# Altium project watch.PrjPcb
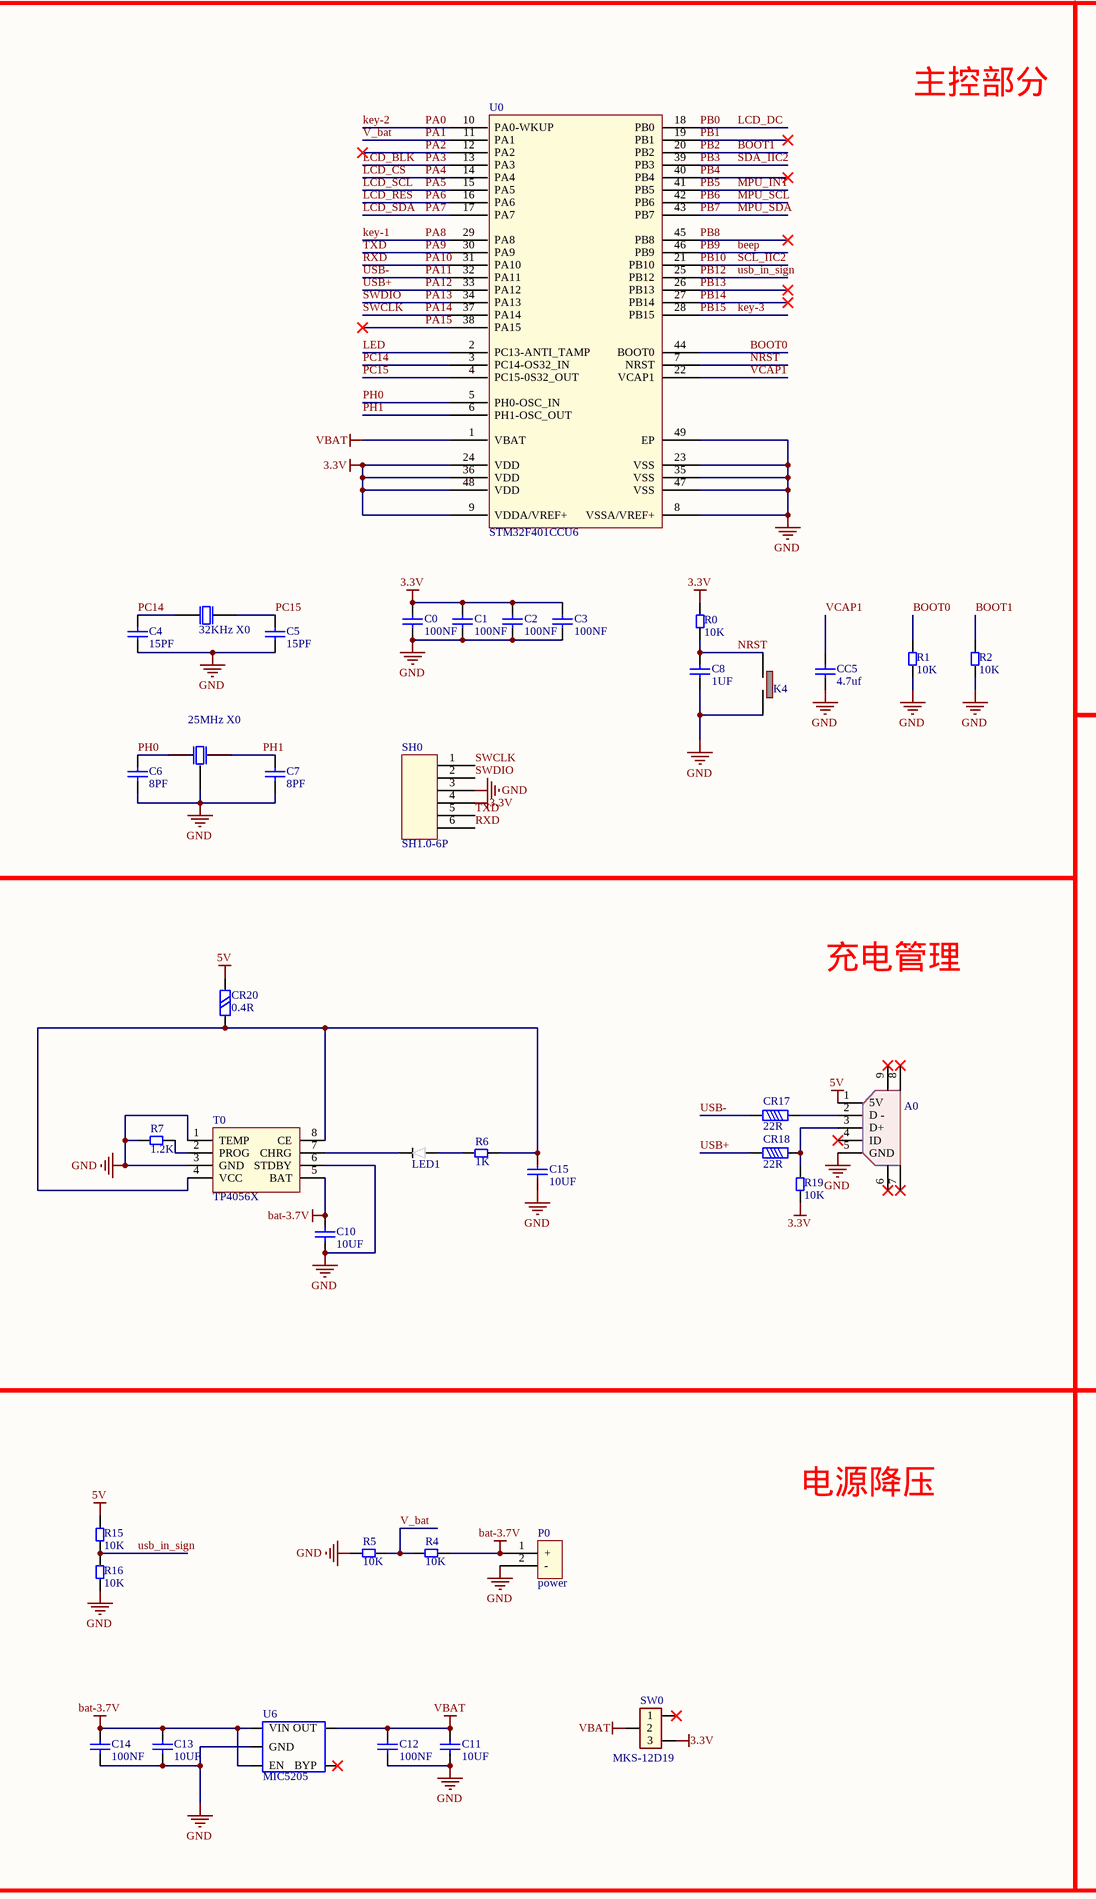
[diagram p0: Sheet-watch.SchDoc, left]
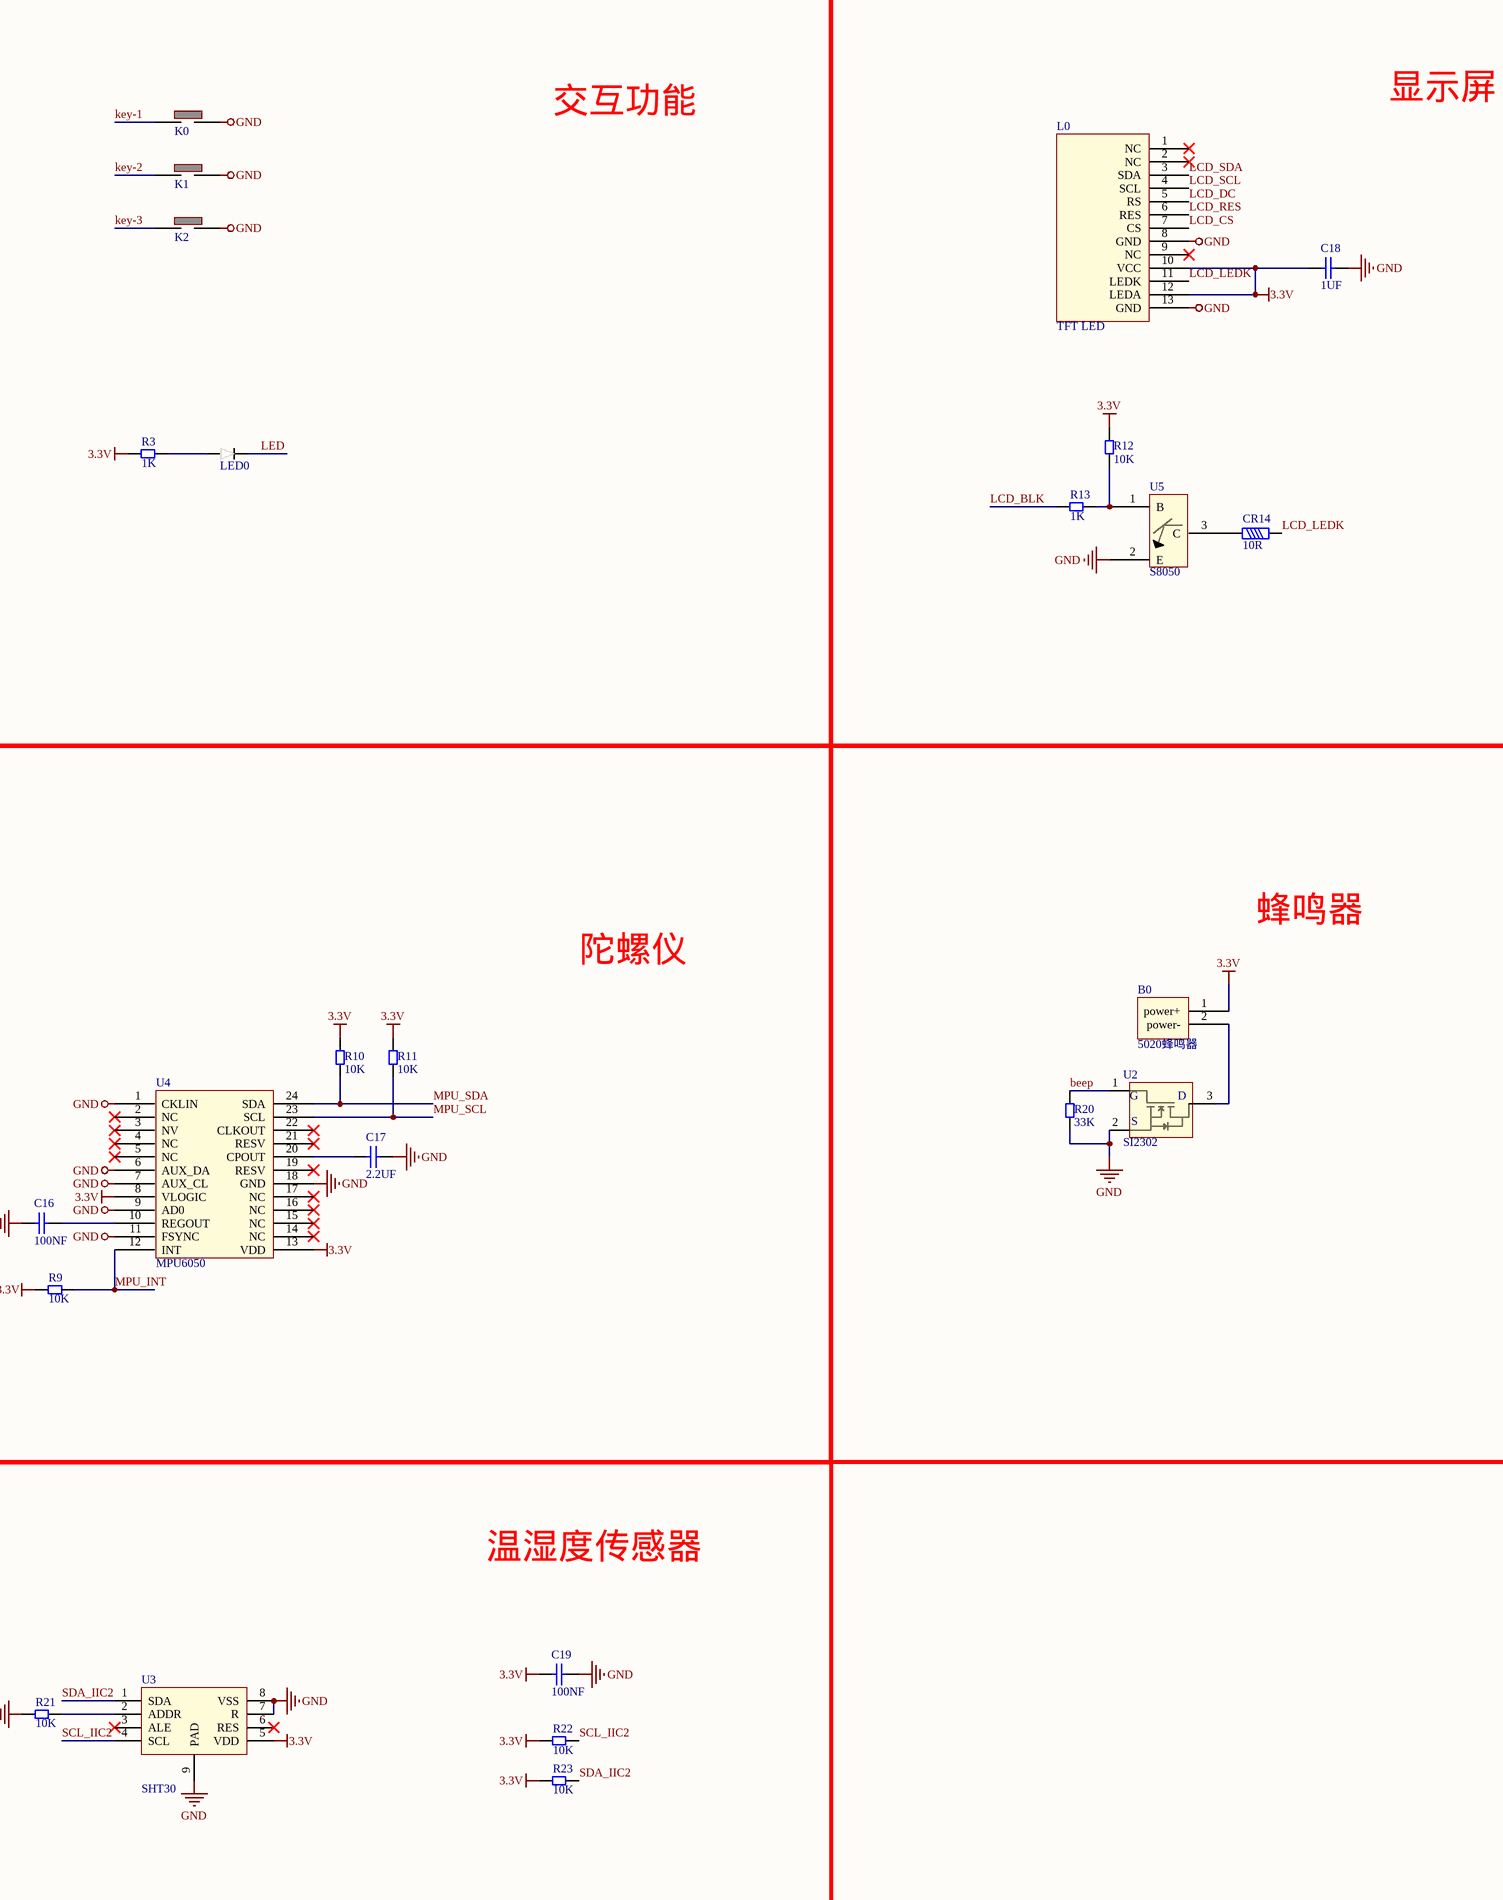
[diagram p1: Sheet-watch.SchDoc, right]
1 sheet, 65 parts. Net scope: global (net labels, ports and power ports of the same name join across sheets).
Board file: PCB-watch.PcbDoc

## Sheet Sheet-watch.SchDoc
size A2; Organization: Protel International P/L; Address1: L3, 12a Rodborough Rd; Address2: Frenchs Forest; Address3: NSW; Address4: Australia 2086

### Parts
25MHz_X0  XTAL 3225 8M  [T 3225]  (value not drawn)
32KHz_X0  XTAL 3215 32.768kKHz  [T 3215]  (value not drawn)
A0  Micro USB  [Micro usb AB]  (value not drawn)
B0  5020蜂鸣器  [5020蜂鸣器]
C0  100NF  [0402Capacitor]
C1  100NF  [0402Capacitor]
C2  100NF  [0402Capacitor]
C3  100NF  [0402Capacitor]
C4  15PF  [0402Capacitor]
C5  15PF  [0402Capacitor]
C6  8PF  [0402Capacitor]
C7  8PF  [0402Capacitor]
C8  1UF  [0402Capacitor]
C10  10UF  [0402Capacitor]
C11  10UF  [0402Capacitor]
C12  100NF  [0402Capacitor]
C13  10UF  [0402Capacitor]
C14  100NF  [0402Capacitor]
C15  10UF  [0402Capacitor]
C16  100NF  [0402Capacitor]
C17  2.2UF  [0402Capacitor]
C18  1UF  [0402Capacitor]
C19  100NF  [0402Capacitor]
CC5  value 4.7uf  [CC1608-0603]  (hidden comment: Cap Chip 0603)
CR14  value 10R  [CR1608-0603]  (hidden comment: Resistor Chip 0603)
CR17  value 22R  [CR1608-0603]  (hidden comment: Resistor Chip 0603)
CR18  value 22R  [CR1608-0603]  (hidden comment: Resistor Chip 0603)
CR20  value 0.4R  [CR3216-1206]  (hidden comment: Resistor Chip 1206)
K0  KEY 3*4  [2*4*3.5 KEY]  (value not drawn)
K1  KEY 3*4  [2*4*3.5 KEY]  (value not drawn)
K2  KEY 3*4  [2*4*3.5 KEY]  (value not drawn)
K4  KEY 3*4  [KEY 3*4]  (value not drawn)
L0  TFT LED  [LCD-1.14IPS-(2)]
LED0  0402 LED  [0402 LED]  (value not drawn)
LED1  0402 LED  [0402 LED]  (value not drawn)
P0  power  [POWER-3.7V]
R0  10K  [0402resistor]
R1  10K  [0402resistor]
R2  10K  [0402resistor]
R3  1K  [0402resistor]
R4  10K  [0402resistor]
R5  10K  [0402resistor]
R6  1K  [0402resistor]
R7  1.2K  [0402resistor]
R9  10K  [0402resistor]
R10  10K  [0402resistor]
R11  10K  [0402resistor]
R12  10K  [0402resistor]
R13  1K  [0402resistor]
R15  10K  [0402resistor]
R16  10K  [0402resistor]
R19  10K  [0402resistor]
R20  33K  [0402resistor]
R21  10K  [0402resistor]
R22  10K  [0402resistor]
R23  10K  [0402resistor]
SH0  SH1.0-6P  [SH1.0-6P]
SW0  MKS-12D19  [SW  MSK-02]
T0  TP4056X  [ESOP8]
U0  STM32F401CCU6  [STM32-UFQFPN48_N]
U2  SI2302  [SOT-23 SI2302]
U3  SHT30  [SHT3X-DIS]
U4  MPU6050  [QFN24 - duplicate]
U5  S8050  [SOT-23 SI2302]
U6  MIC5205  [SOT23-5]

### Blocks framed on the sheet
主控部分: 25MHz_X0 32KHz_X0 C0-C8 CC5 K4 R0-R2 SH0 U0
交互功能: K0-K2 LED0 R3
充电管理: A0 C10 C15 CR17 CR18 CR20 LED1 R6 R7 R19 T0

### Nets
3.3V: B0.1(power+) C0.2 C1.2 C2.2 C3.2 C18.2 C19.2 L0.10(VCC) L0.12(LEDA) R0.2 R3.2 R9.2 R10.2 R11.2 R12.2 R19.1 R22.2 R23.2 SH0.4 SW0.3 U0.9(VDDA/VREF+) U0.24(VDD) U0.36(VDD) U0.48(VDD) U3.5(VDD) U4.8(VLOGIC) U4.13(VDD)
5V: A0.1(5V) CR20.2 R15.2
bat-3.7V: C10.2 C13.2 C14.2 P0.1(+) R4.1 T0.5(BAT) U6.1(VIN) U6.3(EN)
GND: 25MHz_X0.3(GND) A0.5(GND) C0.1 C1.1 C2.1 C3.1 C4.1 C5.1 C6.1 C7.1 C8.1 C10.1 C11.1 C12.1 C13.1 C14.1 C15.1 C16.2 C17.1 C18.1 C19.1 CC5.1 K0.2 K1.2 K2.2 K4.2 L0.8(GND) L0.13(GND) P0.2(-) R1.1 R2.1 R5.2 R7.2 R16.1 R20.1 R21.2 SH0.3 T0.1(TEMP) T0.3(GND) T0.6(STDBY) U0.8(VSSA/VREF+) U0.23(VSS) U0.35(VSS) U0.47(VSS) U0.49(EP) U2.2(SOURCE) U3.7(R) U3.8(VSS) U3.9(PAD) U4.1(CKLIN) U4.6(AUX_DA) U4.7(AUX_CL) U4.9(AD0) U4.11(FSYNC) U4.18(GND) U5.2(E) U6.2(GND)
VBAT: C11.2 C12.2 SW0.2 U0.1(VBAT) U6.5(OUT)
beep: R20.2 U0.46(PB9) U2.1(GATE)  [also labelled PB9]
BOOT0: R1.2 U0.44(BOOT0)
BOOT1: R2.2 U0.20(PB2)  [also labelled PB2]
key-1: K0.1 U0.29(PA8)  [also labelled PA8]
key-2: K1.1 U0.10(PA0-WKUP)  [also labelled PA0]
key-3: K2.1 U0.28(PB15)  [also labelled PB15]
LCD_BLK: R13.2 U0.13(PA3)  [also labelled PA3]
LCD_CS: L0.7(CS) U0.14(PA4)  [also labelled PA4]
LCD_DC: L0.5(RS) U0.18(PB0)  [also labelled PB0]
LCD_LEDK: CR14.2 L0.11(LEDK)
LCD_RES: L0.6(RES) U0.16(PA6)  [also labelled PA6]
LCD_SCL: L0.4(SCL) U0.15(PA5)  [also labelled PA5]
LCD_SDA: L0.3(SDA) U0.17(PA7)  [also labelled PA7]
LED: LED0.2 U0.2(PC13-ANTI_TAMP)
MPU_INT: R9.1 U0.41(PB5) U4.12(INT)  [also labelled PB5]
MPU_SCL: R11.1 U0.42(PB6) U4.23(SCL)  [also labelled PB6]
MPU_SDA: R10.1 U0.43(PB7) U4.24(SDA)  [also labelled PB7]
NRST: C8.2 K4.1 R0.1 U0.7(NRST)
PA1: R4.2 R5.1 U0.11(PA1)  [also labelled V_bat]
PA2: U0.12(PA2)
PA9: SH0.5 U0.30(PA9)  [also labelled TXD]
PA10: SH0.6 U0.31(PA10)  [also labelled RXD]
PA11: CR17.1 U0.32(PA11)  [also labelled USB-]
PA12: CR18.1 U0.33(PA12)  [also labelled USB+]
PA13: SH0.2 U0.34(PA13)  [also labelled SWDIO]
PA14: SH0.1 U0.37(PA14)  [also labelled SWCLK]
PA15: U0.38(PA15)
PB1: U0.19(PB1)
PB3: R23.1 U0.39(PB3) U3.1(SDA)  [also labelled SDA_IIC2]
PB4: U0.40(PB4)
PB8: U0.45(PB8)
PB10: R22.1 U0.21(PB10) U3.4(SCL)  [also labelled SCL_IIC2]
PB12: R15.1 R16.2 U0.25(PB12)  [also labelled usb_in_sign]
PB13: U0.26(PB13)
PB14: U0.27(PB14)
PC14: 32KHz_X0.1(OSC1) C4.2 U0.3(PC14-OS32_IN)
PC15: 32KHz_X0.2(OSC2) C5.2 U0.4(PC15-0S32_OUT)
PH0: 25MHz_X0.1(OSC1) C6.2 U0.5(PH0-OSC_IN)
PH1: 25MHz_X0.2(OSC2) C7.2 U0.6(PH1-OSC_OUT)
VCAP1: CC5.2 U0.22(VCAP1)
NetA0_2: A0.2(D_-) CR17.2
NetA0_3: A0.3(D+) CR18.2 R19.2
NetB0_2: B0.2(power-) U2.3(DRAIN)
NetC15_2: C15.2 CR20.1 R6.1 T0.4(VCC) T0.8(CE)
NetC16_1: C16.1 U4.10(REGOUT)
NetC17_2: C17.2 U4.20(CPOUT)
NetCR14_1: CR14.1 U5.3(C)
NetLED0_1: LED0.1 R3.1
NetLED1_1: LED1.1 R6.2
NetLED1_2: LED1.2 T0.7(CHRG)
NetR7_1: R7.1 T0.2(PROG)
NetR12_1: R12.1 R13.1 U5.1(B)
NetR21_1: R21.1 U3.2(ADDR)

Not connected (* = marked no-connect by the designer): A0 4(ID_)* 6* 7* 8* 9*; L0 1(NC)* 2(NC)* 9(NC)*; SW0 1*; U3 3(ALE)* 6(RES)*; U4 2(NC)* 3(NV)* 4(NC)* 5(NC)* 14(NC)* 15(NC)* 16(NC)* 17(NC)* 19(RESV)* 21(RESV)* 22(CLKOUT)*; U6 4(BYP)*

### Notes on the sheet
- 显示屏
- 蜂鸣器
- 陀螺仪
- 电源降压
- 温湿度传感器
- Title
- Size:
- Date:
- File:
- A2
- Number:
- Time:
- Revision:
- Sheet
- of
- (in symbol SI2302) G; D; S

### Library data of the parts
B0 = 5020蜂鸣器: 蜂鸣器，贴片封装，长宽5.2mm
C0-C8 C10-C19 = 0402 CAP
CC5 = Cap Chip 0603: Polarized Capacitor (Radial); Published: 8-Jun-2000; Revision: July-2002: Re-released for DXP Platform.; Publisher: Altium Limited
CR14 CR17 CR18 = Resistor Chip 0603: Resistor; Published: 8-Jun-2000; Revision: July-2002: Re-released for DXP Platform.; Publisher: Altium Limited
CR20 = Resistor Chip 1206: Resistor; Published: 8-Jun-2000; Revision: July-2002: Re-released for DXP Platform.; Publisher: Altium Limited
L0 = LCD-IPSscreen: 显示屏 1.14寸
R0-R7 R9-R13 R15 R16 R19-R23 = 0402 RES
SH0 = SH1.0-6P: 间距为1mm的端子
SW0 = sw-MSK-12D19
U0 = stm32F411CEU6: stm32单片机 主频100MHz
U2 = SI2302: NMOS场效应MOS管 SOT-23
U3 = SHT30: 温湿度传感器
U4 = MPU6050: 陀螺仪
U5 = S8050: 三极管放大管 NPN型三极管 大电流300ma
U6 = MIC5205: 3.3V降压稳压芯片